# Altium schematic sheet M150.SchDoc
size A2
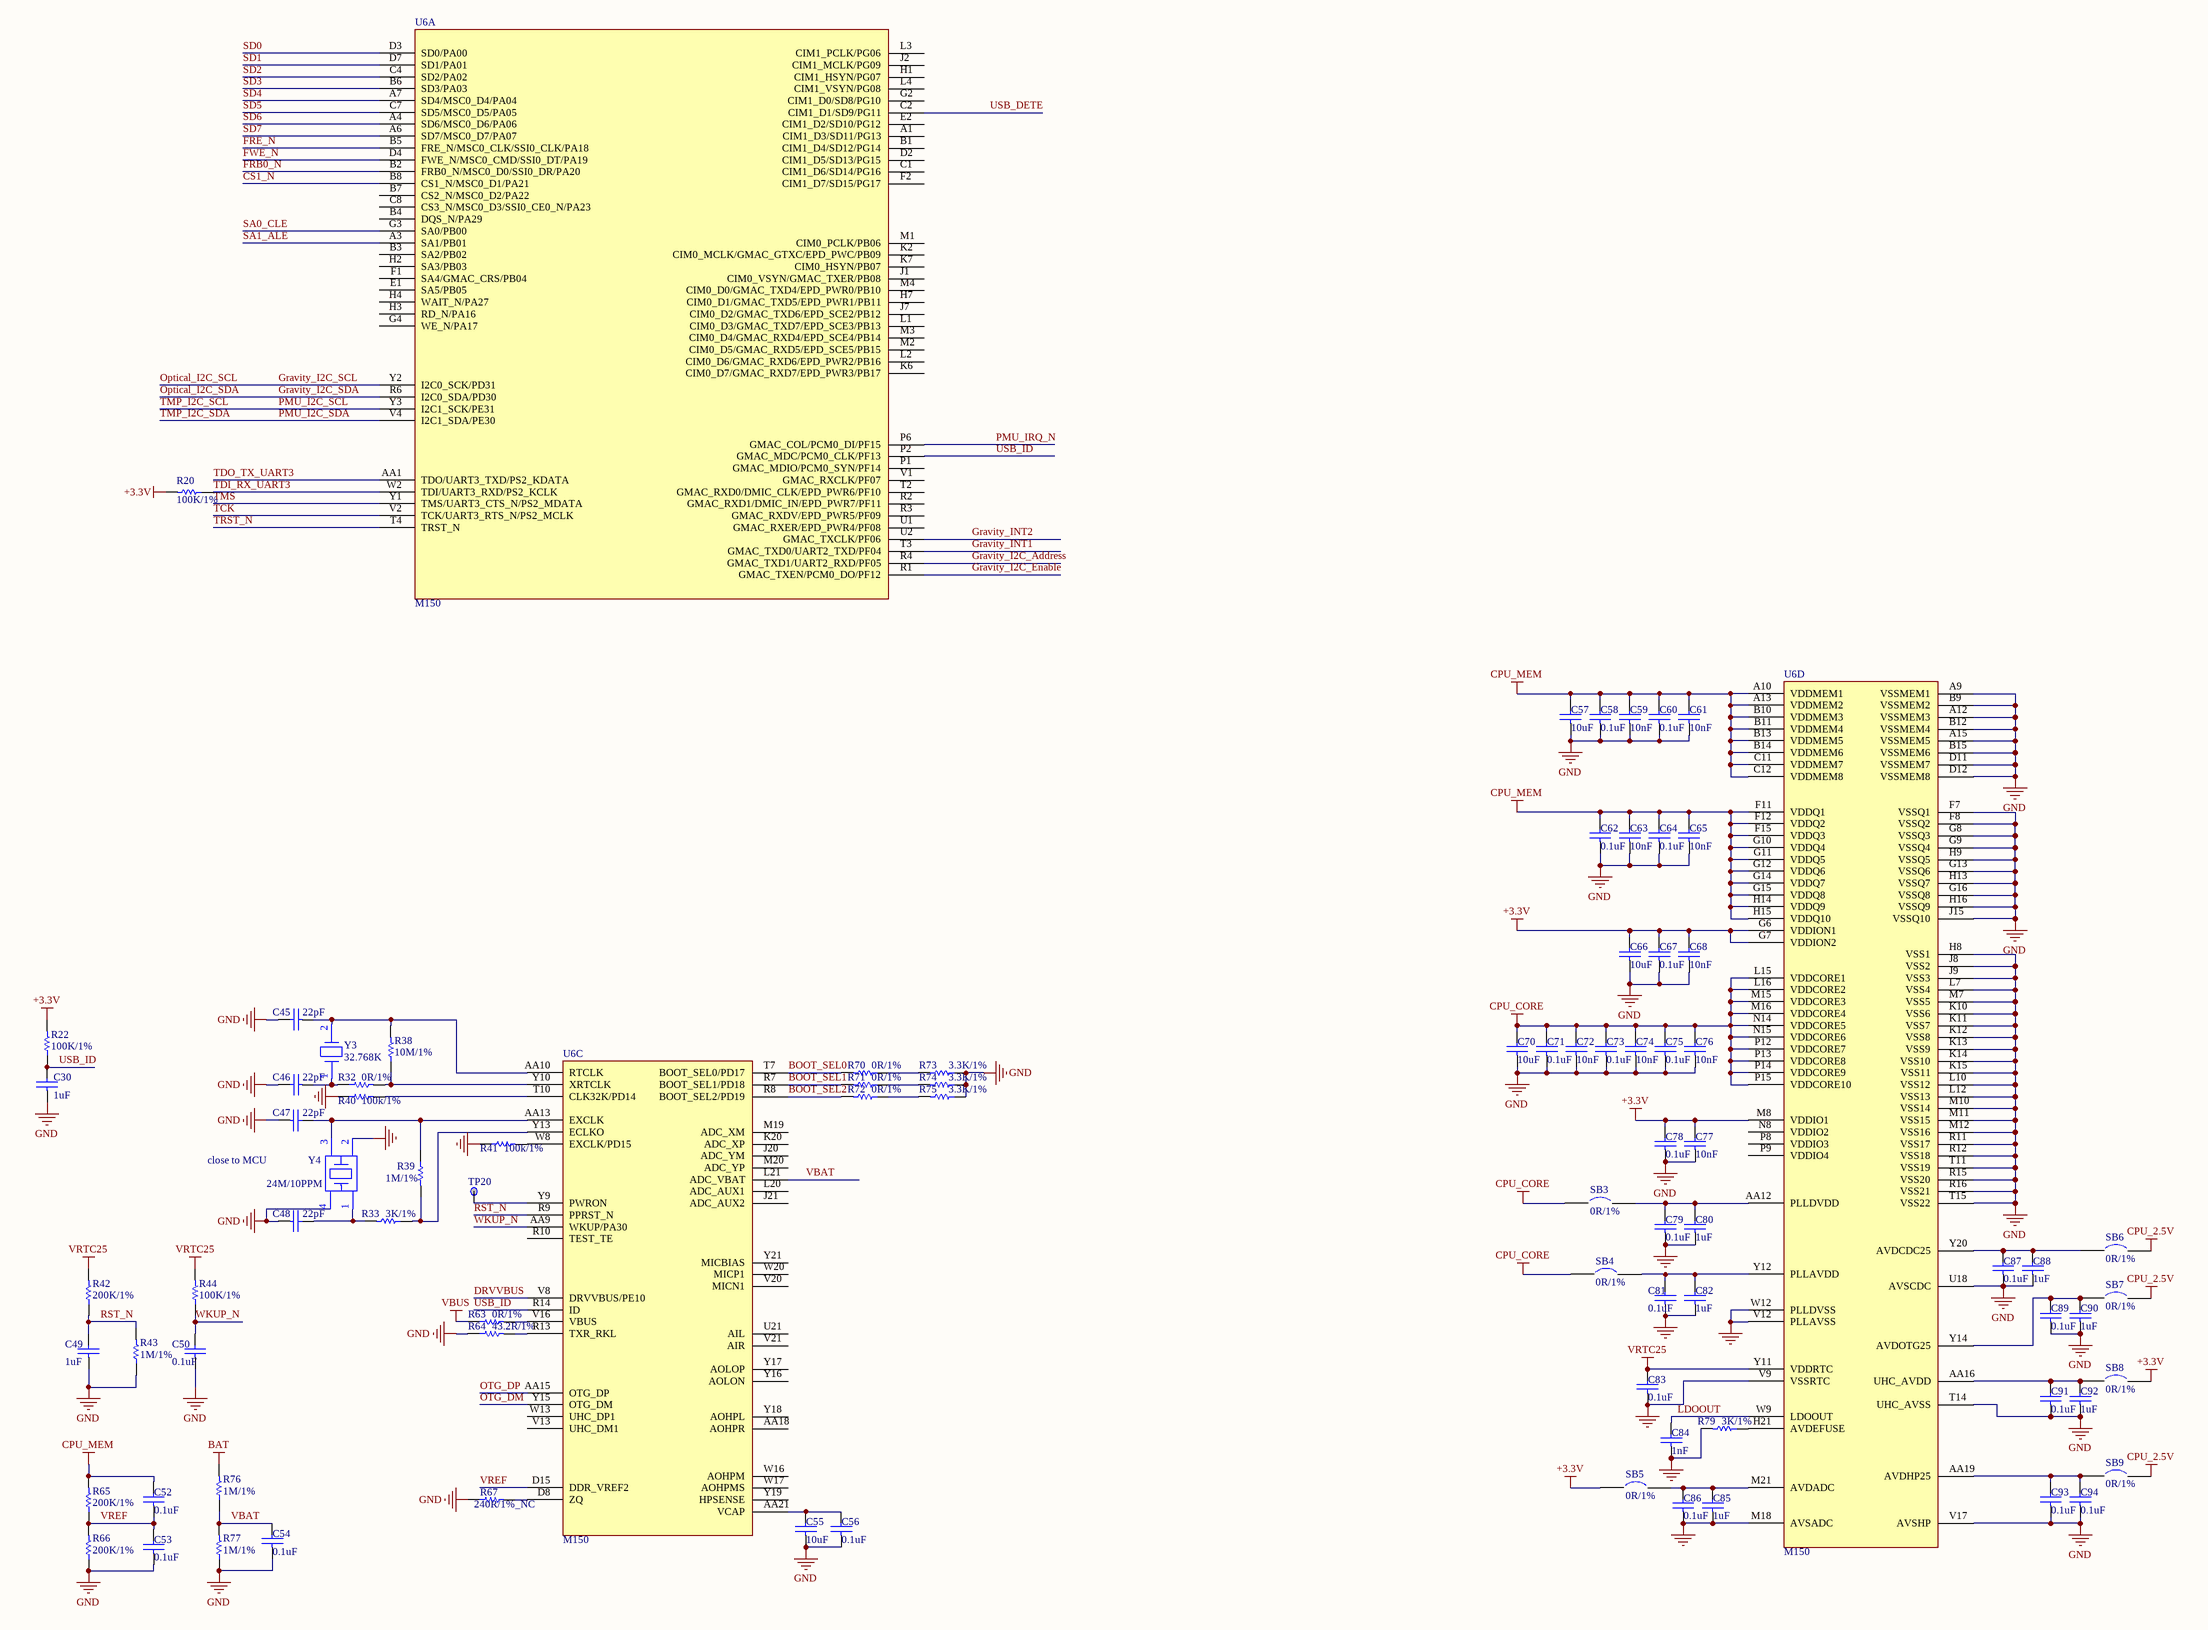
[diagram p0: M150.SchDoc]

## Parts
C30  1uF  [0402C]
C45  22pF  [0402C]
C46  22pF  [0402C]
C47  22pF  [0402C]
C48  22pF  [0402C]
C49  1uF  [0402C]
C50  0.1uF  [0402C]
C52  0.1uF  [0402C]
C53  0.1uF  [0402C]
C54  0.1uF  [0402C]
C55  10uF  [0402C]
C56  0.1uF  [0402C]
C57  10uF  [0402C]
C58  0.1uF  [0402C]
C59  10nF  [0402C]
C60  0.1uF  [0402C]
C61  10nF  [0402C]
C62  0.1uF  [0402C]
C63  10nF  [0402C]
C64  0.1uF  [0402C]
C65  10nF  [0402C]
C66  10uF  [0402C]
C67  0.1uF  [0402C]
C68  10nF  [0402C]
C70  10uF  [0402C]
C71  0.1uF  [0402C]
C72  10nF  [0402C]
C73  0.1uF  [0402C]
C74  10nF  [0402C]
C75  0.1uF  [0402C]
C76  10nF  [0402C]
C77  10nF  [0402C]
C78  0.1uF  [0402C]
C79  0.1uF  [0402C]
C80  1uF  [0402C]
C81  0.1uF  [0402C]
C82  1uF  [0402C]
C83  0.1uF  [0402C]
C84  1nF  [0402C]
C85  1uF  [0402C]
C86  0.1uF  [0402C]
C87  0.1uF  [0402C]
C88  1uF  [0402C]
C89  0.1uF  [0402C]
C90  1uF  [0402C]
C91  0.1uF  [0402C]
C92  1uF  [0402C]
C93  0.1uF  [0402C]
C94  0.1uF  [0402C]
R20  100K/1%  [0603R]
R22  100K/1%  [0603R]
R32  0R/1%  [0603R]
R33  3K/1%  [0603R]
R38  10M/1%  [0603R]
R39  1M/1%  [0603R]
R40  100k/1%  [0603R]
R41  100k/1%  [0603R]
R42  200K/1%  [0603R]
R43  1M/1%  [0603R]
R44  100K/1%  [0603R]
R63  0R/1%  [0603R]
R64  43.2R/1%  [0603R]
R65  200K/1%  [0603R]
R66  200K/1%  [0603R]
R67  240R/1%_NC  [0603R]
R70  0R/1%  [0603R]
R71  0R/1%  [0603R]
R72  0R/1%  [0603R]
R73  3.3K/1%  [0603R]
R74  3.3K/1%  [0603R]
R75  3.3K/1%  [0603R]
R76  1M/1%  [0603R]
R77  1M/1%  [0603R]
R79  3K/1%  [0603R]
SB3  0R/1%  [SB_0603]
SB4  0R/1%  [SB_0603]
SB5  0R/1%  [SB_0603]
SB6  0R/1%  [SB_0603]
SB7  0R/1%  [SB_0603]
SB8  0R/1%  [SB_0603]
SB9  0R/1%  [SB_0603]
TP20  TP  [TP_C40]  (value not drawn)
U6  M150  [Model Name]  (parts A,C,D of 4)
Y3  32.768K  [XTALSMD2-3215]
Y4  24M/10PPM  [XTALSMD2-2520]

## Nets
+3.3V: C66.2 C67.2 C68.2 C77.2 C78.2 R20.2 R22.2 SB5.1 SB8.2 U6.G6(VDDION1) U6.G7(VDDION2) U6.M8(VDDIO1)
BAT: R76.2
CPU_2.5V: SB6.2 SB7.2 SB9.2
CPU_CORE: C70.2 C71.2 C72.2 C73.2 C74.2 C75.2 C76.2 SB3.1 SB4.1 U6.L15(VDDCORE1) U6.L16(VDDCORE2) U6.M15(VDDCORE3) U6.M16(VDDCORE4) U6.N14(VDDCORE5) U6.N15(VDDCORE6) U6.P12(VDDCORE7) U6.P13(VDDCORE8) U6.P14(VDDCORE9) U6.P15(VDDCORE10)
CPU_MEM: C52.2 C57.2 C58.2 C59.2 C60.2 C61.2 C62.2 C63.2 C64.2 C65.2 R65.2 U6.A10(VDDMEM1) U6.A13(VDDMEM2) U6.B10(VDDMEM3) U6.B11(VDDMEM4) U6.B13(VDDMEM5) U6.B14(VDDMEM6) U6.C11(VDDMEM7) U6.C12(VDDMEM8) U6.F11(VDDQ1) U6.F12(VDDQ2) U6.F15(VDDQ3) U6.G10(VDDQ4) U6.G11(VDDQ5) U6.G12(VDDQ6) U6.G14(VDDQ7) U6.G15(VDDQ8) U6.H14(VDDQ9) U6.H15(VDDQ10)
GND: C30.1 C45.2 C46.2 C47.1 C48.1 C49.1 C50.1 C53.1 C54.1 C55.1 C56.1 C57.1 C58.1 C59.1 C60.1 C61.1 C62.1 C63.1 C64.1 C65.1 C66.1 C67.1 C68.1 C70.1 C71.1 C72.1 C73.1 C74.1 C75.1 C76.1 C77.1 C78.1 C79.1 C80.1 C81.1 C82.1 C83.1 C84.1 C85.1 C86.1 C87.1 C88.1 C89.1 C90.1 C91.1 C92.1 C93.1 C94.1 R40.1 R41.1 R43.1 R64.1 R66.1 R67.1 R73.1 R74.1 R75.1 R77.1 R79.2 U6.A9(VSSMEM1) U6.A12(VSSMEM3) U6.A15(VSSMEM5) U6.B9(VSSMEM2) U6.B12(VSSMEM4) U6.B15(VSSMEM6) U6.D11(VSSMEM7) U6.D12(VSSMEM8) U6.F7(VSSQ1) U6.F8(VSSQ2) U6.G8(VSSQ3) U6.G9(VSSQ4) U6.G13(VSSQ6) U6.G16(VSSQ8) U6.H8(VSS1) U6.H9(VSSQ5) U6.H13(VSSQ7) U6.H16(VSSQ9) U6.J8(VSS2) U6.J9(VSS3) U6.J15(VSSQ10) U6.K10(VSS6) U6.K11(VSS7) U6.K12(VSS8) U6.K13(VSS9) U6.K14(VSS10) U6.K15(VSS11) U6.L7(VSS4) U6.L10(VSS12) U6.L12(VSS13) U6.M7(VSS5) U6.M10(VSS14) U6.M11(VSS15) U6.M12(VSS16) U6.M18(AVSADC) U6.R11(VSS17) U6.R12(VSS18) U6.R15(VSS20) U6.R16(VSS21) U6.T11(VSS19) U6.T14(UHC_AVSS) U6.T15(VSS22) U6.U18(AVSCDC) U6.V9(VSSRTC) U6.V12(PLLAVSS) U6.V17(AVSHP) U6.W12(PLLDVSS) Y4.2 Y4.4
VBUS: R63.1
VRTC25: C83.2 R42.2 R44.2 U6.Y11(VDDRTC)
BOOT_SEL0: R70.2 U6.T7(BOOT_SEL0/PD17)
BOOT_SEL1: R71.2 U6.R7(BOOT_SEL1/PD18)
BOOT_SEL2: R72.2 U6.R8(BOOT_SEL2/PD19)
CS1_N: U6.B8(CS1_N/MSC0_D1/PA21)
DRVVBUS: U6.V8(DRVVBUS/PE10)
FRB0_N: U6.B2(FRB0_N/MSC0_D0/SSI0_DR/PA20)
FRE_N: U6.B5(FRE_N/MSC0_CLK/SSI0_CLK/PA18)
FWE_N: U6.D4(FWE_N/MSC0_CMD/SSI0_DT/PA19)
Gravity_I2C_Address: U6.R4(GMAC_TXD1/UART2_RXD/PF05)
Gravity_I2C_Enable: U6.R1(GMAC_TXEN/PCM0_DO/PF12)
Gravity_I2C_SCL: U6.Y2(I2C0_SCK/PD31)  [also labelled Optical_I2C_SCL]
Gravity_I2C_SDA: U6.R6(I2C0_SDA/PD30)  [also labelled Optical_I2C_SDA]
Gravity_INT1: U6.T3(GMAC_TXD0/UART2_TXD/PF04)
Gravity_INT2: U6.U2(GMAC_TXCLK/PF06)
LDOOUT: C84.2 U6.W9(LDOOUT)
OTG_DM: U6.Y15(OTG_DM)
OTG_DP: U6.AA15(OTG_DP)
PMU_I2C_SCL: U6.Y3(I2C1_SCK/PE31)  [also labelled TMP_I2C_SCL]
PMU_I2C_SDA: U6.V4(I2C1_SDA/PE30)  [also labelled TMP_I2C_SDA]
PMU_IRQ_N: U6.P6(GMAC_COL/PCM0_DI/PF15)
RST_N: C49.2 R42.1 R43.2 U6.R9(PPRST_N)
SA0_CLE: U6.G3(SA0/PB00)
SA1_ALE: U6.A3(SA1/PB01)
SD0: U6.D3(SD0/PA00)
SD1: U6.D7(SD1/PA01)
SD2: U6.C4(SD2/PA02)
SD3: U6.B6(SD3/PA03)
SD4: U6.A7(SD4/MSC0_D4/PA04)
SD5: U6.C7(SD5/MSC0_D5/PA05)
SD6: U6.A4(SD6/MSC0_D6/PA06)
SD7: U6.A6(SD7/MSC0_D7/PA07)
TCK: U6.V2(TCK/UART3_RTS_N/PS2_MCLK)
TDI_RX_UART3: R20.1 U6.W2(TDI/UART3_RXD/PS2_KCLK)
TDO_TX_UART3: U6.AA1(TDO/UART3_TXD/PS2_KDATA)
TMS: U6.Y1(TMS/UART3_CTS_N/PS2_MDATA)
TRST_N: U6.T4(TRST_N)
USB_DETE: U6.C2(CIM1_D1/SD9/PG11)
USB_ID: C30.2 R22.1 U6.P2(GMAC_MDC/PCM0_CLK/PF13) U6.R14(ID)
VBAT: C54.2 R76.1 R77.2 U6.L21(ADC_VBAT)
VREF: C52.1 C53.2 R65.1 R66.2 U6.D15(DDR_VREF2)
WKUP_N: C50.2 R44.1 U6.AA9(WKUP/PA30)
NetC45_1: C45.1 R38.2 U6.AA10(RTCLK) Y3.2
NetC46_1: C46.1 R32.1 Y3.1
NetC47_2: C47.2 R39.1 U6.AA13(EXCLK) Y4.3
NetC48_2: C48.2 R33.2 Y4.1
NetC55_2: C55.2 C56.2 U6.AA21(VCAP)
NetC79_2: C79.2 C80.2 SB3.2 U6.AA12(PLLDVDD)
NetC81_2: C81.2 C82.2 SB4.2 U6.Y12(PLLAVDD)
NetC85_2: C85.2 C86.2 SB5.2 U6.M21(AVDADC)
NetC87_2: C87.2 C88.2 SB6.1 U6.Y20(AVDCDC25)
NetC89_2: C89.2 C90.2 SB7.1 U6.Y14(AVDOTG25)
NetC91_2: C91.2 C92.2 SB8.1 U6.AA16(UHC_AVDD)
NetC93_2: C93.2 C94.2 SB9.1 U6.AA19(AVDHP25)
NetR32_2: R32.2 R38.1 U6.Y10(XRTCLK)
NetR33_1: R33.1 R39.2 U6.Y13(ECLKO)
NetR40_2: R40.2 U6.T10(CLK32K/PD14)
NetR41_2: R41.2 U6.W8(EXCLK/PD15)
NetR63_2: R63.2 U6.V16(VBUS)
NetR64_2: R64.2 U6.R13(TXR_RKL)
NetR67_2: R67.2 U6.D8(ZQ)
NetR70_1: R70.1 R73.2
NetR71_1: R71.1 R74.2
NetR72_1: R72.1 R75.2
NetR79_1: R79.1 U6.H21(AVDEFUSE)
NetTP20_1: TP20.1 U6.Y9(PWRON)

Not connected (* = marked no-connect by the designer): U6 A1(CIM1_D3/SD11/PG13) AA18(AOHPR) B1(CIM1_D4/SD12/PG14) B3(SA2/PB02) B4(DQS_N/PA29) B7(CS2_N/MSC0_D2/PA22) C1(CIM1_D6/SD14/PG16) C8(CS3_N/MSC0_D3/SSI0_CE0_N/PA23) D2(CIM1_D5/SD13/PG15) E1(SA5/PB05) E2(CIM1_D2/SD10/PG12) F1(SA4/GMAC_CRS/PB04) F2(CIM1_D7/SD15/PG17) G2(CIM1_D0/SD8/PG10) G4(WE_N/PA17) H1(CIM1_HSYN/PG07) H2(SA3/PB03) H3(RD_N/PA16) H4(WAIT_N/PA27) H7(CIM0_D1/GMAC_TXD5/EPD_PWR1/PB11) J1(CIM0_VSYN/GMAC_TXER/PB08) J2(CIM1_MCLK/PG09) J7(CIM0_D2/GMAC_TXD6/EPD_SCE2/PB12) J20(ADC_YM) J21(ADC_AUX2) K2(CIM0_MCLK/GMAC_GTXC/EPD_PWC/PB09) K6(CIM0_D7/GMAC_RXD7/EPD_PWR3/PB17) K7(CIM0_HSYN/PB07) K20(ADC_XP) L1(CIM0_D3/GMAC_TXD7/EPD_SCE3/PB13) L2(CIM0_D6/GMAC_RXD6/EPD_PWR2/PB16) L3(CIM1_PCLK/PG06) L4(CIM1_VSYN/PG08) L20(ADC_AUX1) M1(CIM0_PCLK/PB06) M2(CIM0_D5/GMAC_RXD5/EPD_SCE5/PB15) M3(CIM0_D4/GMAC_RXD4/EPD_SCE4/PB14) M4(CIM0_D0/GMAC_TXD4/EPD_PWR0/PB10) M19(ADC_XM) M20(ADC_YP) N8(VDDIO2) P1(GMAC_MDIO/PCM0_SYN/PF14) P8(VDDIO3) P9(VDDIO4) R2(GMAC_RXD1/DMIC_IN/EPD_PWR7/PF11) R3(GMAC_RXDV/EPD_PWR5/PF09) R10(TEST_TE) T2(GMAC_RXD0/DMIC_CLK/EPD_PWR6/PF10) U1(GMAC_RXER/EPD_PWR4/PF08) U21(AIL) V1(GMAC_RXCLK/PF07) V13(UHC_DM1) V20(MICN1) V21(AIR) W13(UHC_DP1) W16(AOHPM) W17(AOHPMS) W20(MICP1) Y16(AOLON) Y17(AOLOP) Y18(AOHPL) Y19(HPSENSE) Y21(MICBIAS)

## Notes on the sheet
- close to MCU

## Library data of the parts
C30 C47-C50 C52-C68 C70-C94 = CAP: 厂家：Murata，型号：GRM1555C1H120JA01D
C45 C46 = CAP: Capacitor; Ordered by: Subcon
R20 R22 R32 R33 R38-R44 R63-R67 R70-R77 R79 = Res1: Resistor; Value: 1K; Ordered by: Subcon; Published: 8-Jun-2000; Revision: July-2002: Re-released for DXP Platform.; Publisher: Altium Limited
SB3-SB9 = Circuit Breaker: Ordered by: Subcon; Comments: Solder bridge; Fitted: NO; Published: 24-Mar-1999; Revision: July-2002: Re-released for DXP Platform.; Publisher: Altium Limited
TP20 = TP: Ordered by: Subcon
Y3 = CR: 厂家：EPSON，型号：Q13FC1350000400
Y4 = CRYSTAL2: 厂家：EPSON，型号：Q24FA20H0004400